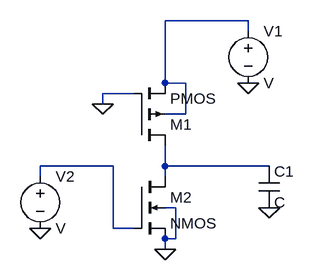
[diagram p0: schematic ECE3006_Exp5_24022023.asc]
ECE3006_Exp5_24022023.asc, the LTspice schematic file:
Version 4
SHEET 1 880 680
WIRE 64 -208 -64 -208
WIRE 64 -192 64 -208
WIRE -64 -112 -64 -208
WIRE -32 -112 -64 -112
WIRE -112 -96 -160 -96
WIRE -160 -80 -160 -96
WIRE -32 -64 -32 -112
WIRE -32 -64 -64 -64
WIRE -144 16 -256 16
WIRE -64 16 -64 -16
WIRE 96 16 -64 16
WIRE -256 32 -256 16
WIRE -64 32 -64 16
WIRE -48 80 -64 80
WIRE -144 112 -144 16
WIRE -112 112 -144 112
WIRE -48 128 -48 80
WIRE -48 128 -64 128
WIRE -64 144 -64 128
FLAG -256 112 0
FLAG 64 -112 0
FLAG 96 80 0
FLAG -64 144 0
FLAG -160 -80 0
SYMBOL pmos4 -112 -16 M180
SYMATTR InstName M1
SYMBOL nmos4 -112 32 R0
SYMATTR InstName M2
SYMBOL voltage 64 -208 R0
SYMATTR InstName V1
SYMBOL voltage -256 16 R0
SYMATTR InstName V2
SYMBOL cap 80 16 R0
SYMATTR InstName C1

The netlist it stands for:
* ECE3006_Exp5_24022023.asc
M1 N003 0 N001 N001 PMOS
M2 N003 N002 0 0 NMOS
V1 N001 0 V
V2 N002 0 V
C1 N003 0 C
.model NMOS NMOS
.model PMOS PMOS
.lib standard.mos
.backanno
.end